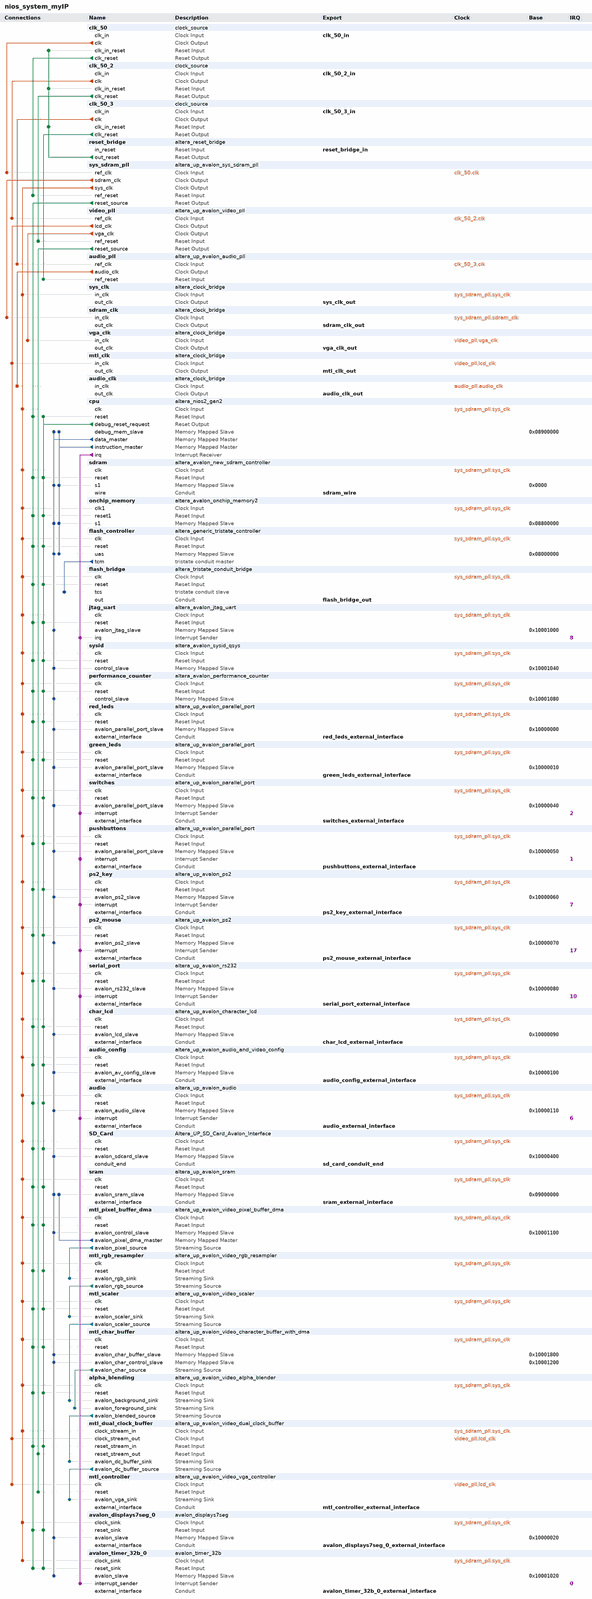
[diagram p0: system contents, whole]
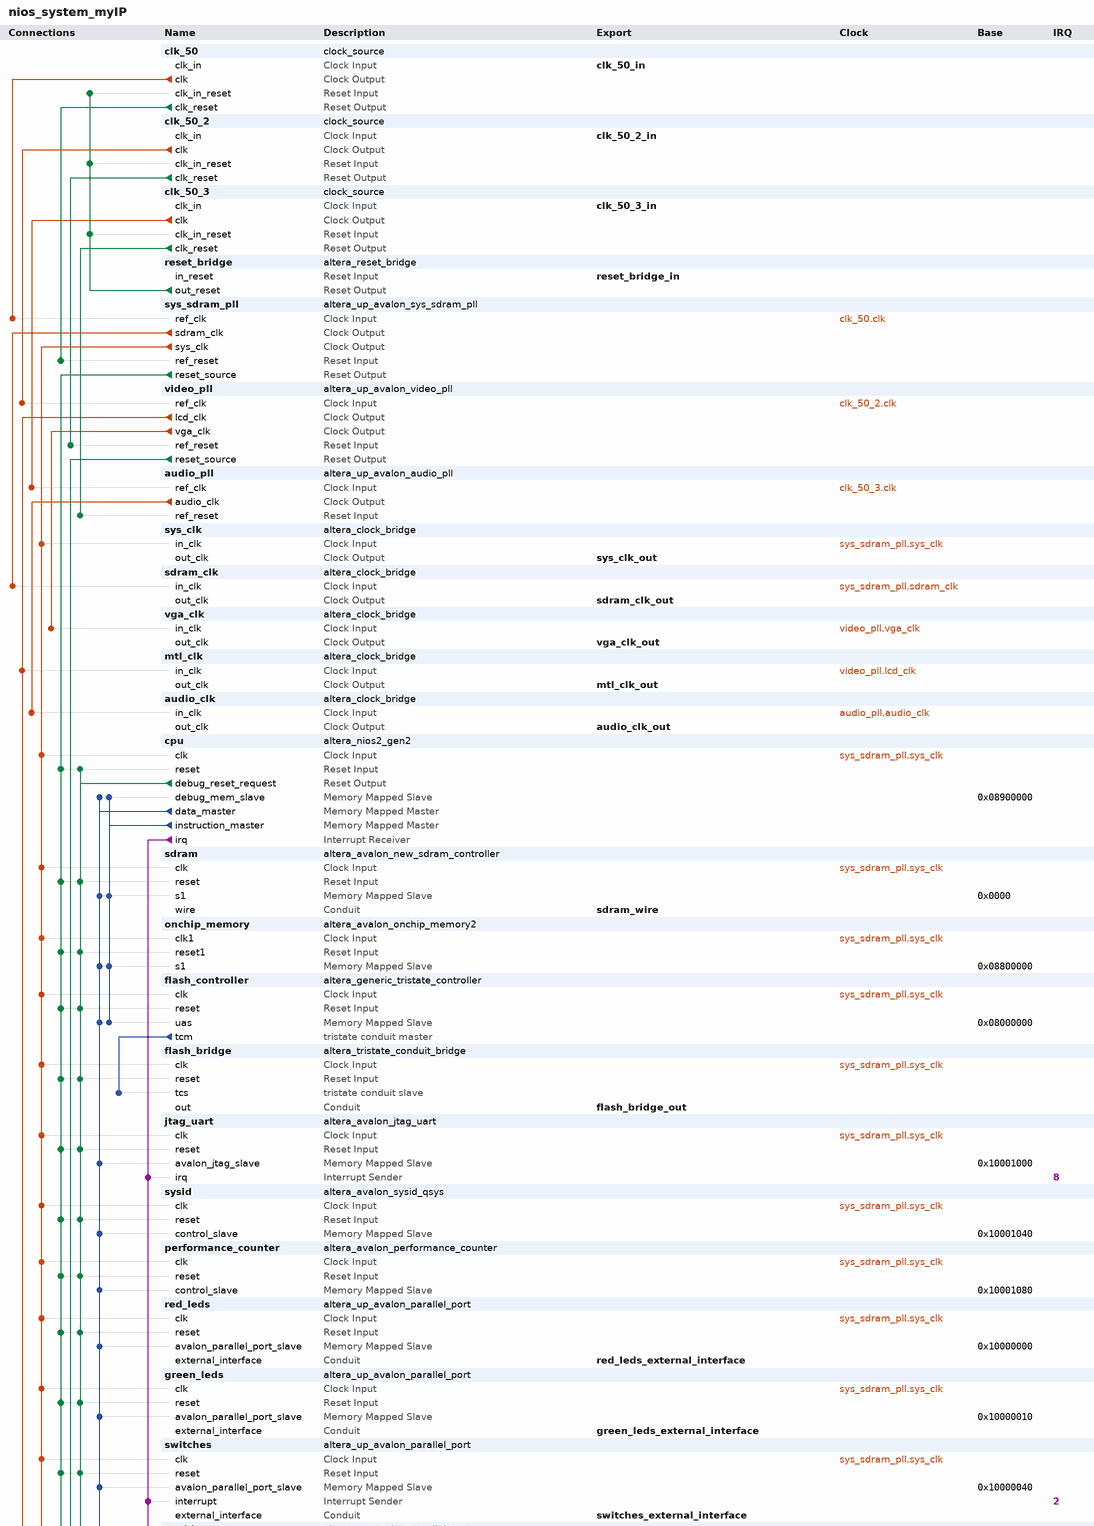
[diagram p1: system contents, upper part]
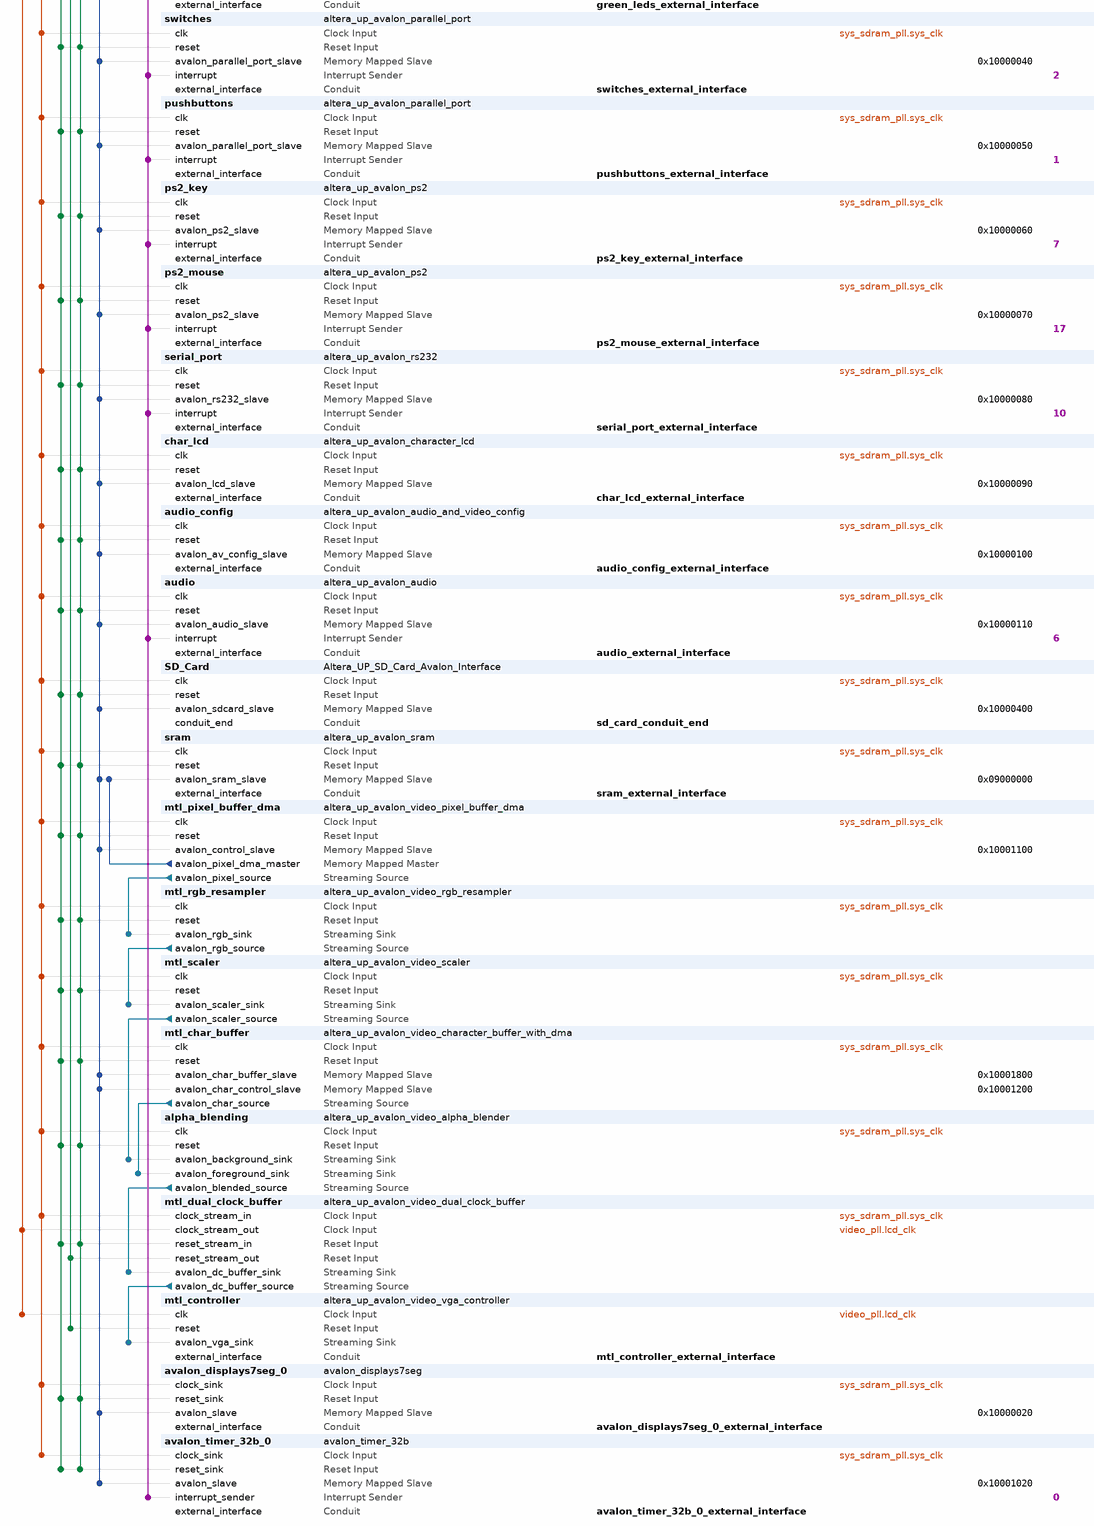
[diagram p2: system contents, lower part]
# Platform Designer (Qsys) system nios_system_myIP, Cyclone IV E EP4CE115F29C7
# Parameters at their usual value, and those the tool derives, are not listed.
package require -exact qsys 17.1
create_system nios_system_myIP
set_project_property DEVICE_FAMILY {Cyclone IV E}
set_project_property DEVICE EP4CE115F29C7

add_instance clk_50 clock_source 17.1
set_instance_parameter_value clk_50 clockFrequency 50000000

add_instance clk_50_2 clock_source 17.1
set_instance_parameter_value clk_50_2 clockFrequency 50000000

add_instance clk_50_3 clock_source 17.1
set_instance_parameter_value clk_50_3 clockFrequency 50000000

add_instance reset_bridge altera_reset_bridge 17.1
set_instance_parameter_value reset_bridge ACTIVE_LOW_RESET 1
set_instance_parameter_value reset_bridge SYNCHRONOUS_EDGES none

add_instance sys_sdram_pll altera_up_avalon_sys_sdram_pll 17.1
set_instance_parameter_value sys_sdram_pll CV_boards DE10-Standard
set_instance_parameter_value sys_sdram_pll gui_outclk 50.0
set_instance_parameter_value sys_sdram_pll gui_refclk 50.0

add_instance video_pll altera_up_avalon_video_pll 17.1
set_instance_parameter_value video_pll camera {5MP Digital Camera (THDB_D5M)}
set_instance_parameter_value video_pll gui_refclk 50.0
set_instance_parameter_value video_pll lcd {7" LCD on VEEK-MT and MTL/MTL2 Modules}
set_instance_parameter_value video_pll lcd_clk_en true

add_instance audio_pll altera_up_avalon_audio_pll 17.1
set_instance_parameter_value audio_pll gui_refclk 50.0

add_instance sys_clk altera_clock_bridge 17.1
set_instance_parameter_value sys_clk DERIVED_CLOCK_RATE 50000000
set_instance_parameter_value sys_clk EXPLICIT_CLOCK_RATE 0

add_instance sdram_clk altera_clock_bridge 17.1
set_instance_parameter_value sdram_clk DERIVED_CLOCK_RATE 50000000
set_instance_parameter_value sdram_clk EXPLICIT_CLOCK_RATE 0

add_instance vga_clk altera_clock_bridge 17.1
set_instance_parameter_value vga_clk DERIVED_CLOCK_RATE 25000000
set_instance_parameter_value vga_clk EXPLICIT_CLOCK_RATE 0

add_instance mtl_clk altera_clock_bridge 17.1
set_instance_parameter_value mtl_clk DERIVED_CLOCK_RATE 33300000
set_instance_parameter_value mtl_clk EXPLICIT_CLOCK_RATE 0

add_instance audio_clk altera_clock_bridge 17.1
set_instance_parameter_value audio_clk DERIVED_CLOCK_RATE 12288000
set_instance_parameter_value audio_clk EXPLICIT_CLOCK_RATE 0

add_instance cpu altera_nios2_gen2 17.1
set_instance_parameter_value cpu dcache_size 2048
set_instance_parameter_value cpu debug_datatrigger 2
set_instance_parameter_value cpu debug_hwbreakpoint 2
set_instance_parameter_value cpu exceptionSlave sdram.s1
set_instance_parameter_value cpu icache_size 4096
set_instance_parameter_value cpu impl Fast
set_instance_parameter_value cpu io_regionbase 268435456
set_instance_parameter_value cpu io_regionsize 16384
set_instance_parameter_value cpu resetSlave sdram.s1

add_instance sdram altera_avalon_new_sdram_controller 17.1
set_instance_parameter_value sdram TAC 5.5
set_instance_parameter_value sdram TRCD 20.0
set_instance_parameter_value sdram TRP 20.0
set_instance_parameter_value sdram casLatency 3
set_instance_parameter_value sdram columnWidth 10
set_instance_parameter_value sdram dataWidth 32
set_instance_parameter_value sdram generateSimulationModel true
set_instance_parameter_value sdram model single_Micron_MT48LC4M32B2_7_chip
set_instance_parameter_value sdram numberOfBanks 4
set_instance_parameter_value sdram numberOfChipSelects 1
set_instance_parameter_value sdram powerUpDelay 200.0
set_instance_parameter_value sdram refreshPeriod 7.8125
set_instance_parameter_value sdram rowWidth 13

add_instance onchip_memory altera_avalon_onchip_memory2 17.1
set_instance_parameter_value onchip_memory dataWidth 32
set_instance_parameter_value onchip_memory dualPort false
set_instance_parameter_value onchip_memory initMemContent true
set_instance_parameter_value onchip_memory initializationFileName onchip_mem.hex
set_instance_parameter_value onchip_memory memorySize 32768

add_instance flash_controller altera_generic_tristate_controller 17.1
set_instance_parameter_value flash_controller ACTIVE_LOW_BEGINTRANSFER 0
set_instance_parameter_value flash_controller ACTIVE_LOW_BYTEENABLE 0
set_instance_parameter_value flash_controller ACTIVE_LOW_OUTPUTENABLE 0
set_instance_parameter_value flash_controller ACTIVE_LOW_READ 1
set_instance_parameter_value flash_controller CHIPSELECT_THROUGH_READLATENCY 0
set_instance_parameter_value flash_controller INTERFACE_ASSIGNMENT_KEYS embeddedsw.configuration.isFlash,embeddedsw.configuration.isMemoryDevice,embeddedsw.configuration.isNonVolatileStorage
set_instance_parameter_value flash_controller INTERFACE_ASSIGNMENT_VALUES 1,1,1
set_instance_parameter_value flash_controller MODULE_ASSIGNMENT_KEYS embeddedsw.configuration.hwClassnameDriverSupportList,embeddedsw.configuration.hwClassnameDriverSupportDefault,embeddedsw.CMacro.SETUP_VALUE,embeddedsw.CMacro.WAIT_VALUE,embeddedsw.CMacro.HOLD_VALUE,embeddedsw.CMacro.TIMING_UNITS,embeddedsw.CMacro.SIZE,embeddedsw.memoryInfo.MEM_INIT_DATA_WIDTH,embeddedsw.memoryInfo.HAS_BYTE_LANE,embeddedsw.memoryInfo.IS_FLASH,embeddedsw.memoryInfo.GENERATE_DAT_SYM,embeddedsw.memoryInfo.GENERATE_FLASH,embeddedsw.memoryInfo.DAT_SYM_INSTALL_DIR,embeddedsw.memoryInfo.FLASH_INSTALL_DIR
set_instance_parameter_value flash_controller MODULE_ASSIGNMENT_VALUES altera_avalon_lan91c111:altera_avalon_cfi_flash,altera_avalon_cfi_flash,0,0,0,ns,8388608u,8,0,1,1,1,SIM_DIR,APP_DIR
set_instance_parameter_value flash_controller TCM_ADDRESS_W 23
set_instance_parameter_value flash_controller TCM_BYTEENABLE_W 1
set_instance_parameter_value flash_controller TCM_DATA_HOLD 60
set_instance_parameter_value flash_controller TCM_DATA_W 8
set_instance_parameter_value flash_controller TCM_MAX_PENDING_READ_TRANSACTIONS 3
set_instance_parameter_value flash_controller TCM_READLATENCY 2
set_instance_parameter_value flash_controller TCM_READ_WAIT 160
set_instance_parameter_value flash_controller TCM_SETUP_WAIT 60
set_instance_parameter_value flash_controller TCM_SYMBOLS_PER_WORD 1
set_instance_parameter_value flash_controller TCM_TIMING_UNITS 0
set_instance_parameter_value flash_controller TCM_TURNAROUND_TIME 2
set_instance_parameter_value flash_controller TCM_WRITE_WAIT 160
set_instance_parameter_value flash_controller USE_BEGINTRANSFER 0
set_instance_parameter_value flash_controller USE_BYTEENABLE 0
set_instance_parameter_value flash_controller USE_OUTPUTENABLE 0
set_instance_parameter_value flash_controller USE_READ 1

add_instance flash_bridge altera_tristate_conduit_bridge 17.1

add_instance jtag_uart altera_avalon_jtag_uart 17.1
set_instance_parameter_value jtag_uart simInteractiveOptions NO_INTERACTIVE_WINDOWS

add_instance sysid altera_avalon_sysid_qsys 17.1
set_instance_parameter_value sysid id 0

add_instance performance_counter altera_avalon_performance_counter 17.1
set_instance_parameter_value performance_counter numberOfSections 3

add_instance red_leds altera_up_avalon_parallel_port 17.1
set_instance_parameter_value red_leds board DE2-115
set_instance_parameter_value red_leds capture false
set_instance_parameter_value red_leds edge Rising
set_instance_parameter_value red_leds irq false
set_instance_parameter_value red_leds leds Red
set_instance_parameter_value red_leds preset LEDs

add_instance green_leds altera_up_avalon_parallel_port 17.1
set_instance_parameter_value green_leds board DE2-115
set_instance_parameter_value green_leds capture false
set_instance_parameter_value green_leds edge Rising
set_instance_parameter_value green_leds irq false
set_instance_parameter_value green_leds preset LEDs

add_instance switches altera_up_avalon_parallel_port 17.1
set_instance_parameter_value switches board DE2-115
set_instance_parameter_value switches capture true
set_instance_parameter_value switches edge Either
set_instance_parameter_value switches irq true
set_instance_parameter_value switches preset {Slider Switches}

add_instance pushbuttons altera_up_avalon_parallel_port 17.1
set_instance_parameter_value pushbuttons board DE2-115
set_instance_parameter_value pushbuttons capture true
set_instance_parameter_value pushbuttons edge Falling
set_instance_parameter_value pushbuttons irq true
set_instance_parameter_value pushbuttons preset Pushbuttons

add_instance ps2_key altera_up_avalon_ps2 17.1

add_instance ps2_mouse altera_up_avalon_ps2 17.1

add_instance serial_port altera_up_avalon_rs232 17.1
set_instance_parameter_value serial_port baud 115200
set_instance_parameter_value serial_port parity None

add_instance char_lcd altera_up_avalon_character_lcd 17.1
set_instance_parameter_value char_lcd cursor Both

add_instance audio_config altera_up_avalon_audio_and_video_config 17.1
set_instance_parameter_value audio_config audio_in {Microphone to ADC}
set_instance_parameter_value audio_config bit_length 32
set_instance_parameter_value audio_config board DE10-Standard
set_instance_parameter_value audio_config line_in_bypass true
set_instance_parameter_value audio_config sampling_rate {48 kHz}
set_instance_parameter_value audio_config video_format PAL

add_instance audio altera_up_avalon_audio 17.1
set_instance_parameter_value audio audio_in true
set_instance_parameter_value audio avalon_bus_type {Memory Mapped}
set_instance_parameter_value audio dw 32

add_instance SD_Card Altera_UP_SD_Card_Avalon_Interface 17.1

add_instance sram altera_up_avalon_sram 17.1
set_instance_parameter_value sram board DE2-115
set_instance_parameter_value sram pixel_buffer true

add_instance mtl_pixel_buffer_dma altera_up_avalon_video_pixel_buffer_dma 17.1
set_instance_parameter_value mtl_pixel_buffer_dma addr_mode X-Y
set_instance_parameter_value mtl_pixel_buffer_dma back_start_address 150994944
set_instance_parameter_value mtl_pixel_buffer_dma color_space {16-bit RGB}
set_instance_parameter_value mtl_pixel_buffer_dma image_height 240
set_instance_parameter_value mtl_pixel_buffer_dma image_width 400
set_instance_parameter_value mtl_pixel_buffer_dma start_address 150994944

add_instance mtl_rgb_resampler altera_up_avalon_video_rgb_resampler 17.1
set_instance_parameter_value mtl_rgb_resampler alpha 1023
set_instance_parameter_value mtl_rgb_resampler input_type {16-bit RGB}
set_instance_parameter_value mtl_rgb_resampler output_type {30-bit RGB}

add_instance mtl_scaler altera_up_avalon_video_scaler 17.1
set_instance_parameter_value mtl_scaler color_bits 10
set_instance_parameter_value mtl_scaler color_planes 3
set_instance_parameter_value mtl_scaler height_scaling 2
set_instance_parameter_value mtl_scaler width_in 400
set_instance_parameter_value mtl_scaler width_scaling 2

add_instance mtl_char_buffer altera_up_avalon_video_character_buffer_with_dma 17.1
set_instance_parameter_value mtl_char_buffer enable_transparency true
set_instance_parameter_value mtl_char_buffer vga_device {LCD with touchscreen (TRDB_LTM)}

add_instance alpha_blending altera_up_avalon_video_alpha_blender 17.1

add_instance mtl_dual_clock_buffer altera_up_avalon_video_dual_clock_buffer 17.1
set_instance_parameter_value mtl_dual_clock_buffer color_bits 10

add_instance mtl_controller altera_up_avalon_video_vga_controller 17.1
set_instance_parameter_value mtl_controller board DE2-115
set_instance_parameter_value mtl_controller resolution {VGA 640x480}

add_instance avalon_displays7seg_0 avalon_displays7seg 1.0
set_instance_parameter_value avalon_displays7seg_0 invert 1

add_instance avalon_timer_32b_0 avalon_timer_32b 1.0

# connections
add_connection audio_pll.audio_clk audio_clk.in_clk clock
add_connection clk_50.clk sys_sdram_pll.ref_clk clock
add_connection clk_50_2.clk video_pll.ref_clk clock
add_connection clk_50_3.clk audio_pll.ref_clk clock
add_connection sys_sdram_pll.sdram_clk sdram_clk.in_clk clock
add_connection sys_sdram_pll.sys_clk alpha_blending.clk clock
add_connection sys_sdram_pll.sys_clk audio.clk clock
add_connection sys_sdram_pll.sys_clk audio_config.clk clock
add_connection sys_sdram_pll.sys_clk avalon_displays7seg_0.clock_sink clock
add_connection sys_sdram_pll.sys_clk avalon_timer_32b_0.clock_sink clock
add_connection sys_sdram_pll.sys_clk char_lcd.clk clock
add_connection sys_sdram_pll.sys_clk cpu.clk clock
add_connection sys_sdram_pll.sys_clk flash_bridge.clk clock
add_connection sys_sdram_pll.sys_clk flash_controller.clk clock
add_connection sys_sdram_pll.sys_clk green_leds.clk clock
add_connection sys_sdram_pll.sys_clk jtag_uart.clk clock
add_connection sys_sdram_pll.sys_clk mtl_char_buffer.clk clock
add_connection sys_sdram_pll.sys_clk mtl_dual_clock_buffer.clock_stream_in clock
add_connection sys_sdram_pll.sys_clk mtl_pixel_buffer_dma.clk clock
add_connection sys_sdram_pll.sys_clk mtl_rgb_resampler.clk clock
add_connection sys_sdram_pll.sys_clk mtl_scaler.clk clock
add_connection sys_sdram_pll.sys_clk onchip_memory.clk1 clock
add_connection sys_sdram_pll.sys_clk performance_counter.clk clock
add_connection sys_sdram_pll.sys_clk ps2_key.clk clock
add_connection sys_sdram_pll.sys_clk ps2_mouse.clk clock
add_connection sys_sdram_pll.sys_clk pushbuttons.clk clock
add_connection sys_sdram_pll.sys_clk red_leds.clk clock
add_connection sys_sdram_pll.sys_clk SD_Card.clk clock
add_connection sys_sdram_pll.sys_clk sdram.clk clock
add_connection sys_sdram_pll.sys_clk serial_port.clk clock
add_connection sys_sdram_pll.sys_clk sram.clk clock
add_connection sys_sdram_pll.sys_clk switches.clk clock
add_connection sys_sdram_pll.sys_clk sys_clk.in_clk clock
add_connection sys_sdram_pll.sys_clk sysid.clk clock
add_connection video_pll.lcd_clk mtl_clk.in_clk clock
add_connection video_pll.lcd_clk mtl_controller.clk clock
add_connection video_pll.lcd_clk mtl_dual_clock_buffer.clock_stream_out clock
add_connection video_pll.vga_clk vga_clk.in_clk clock
add_connection clk_50.clk_reset sys_sdram_pll.ref_reset reset
add_connection clk_50_2.clk_reset video_pll.ref_reset reset
add_connection clk_50_3.clk_reset audio_pll.ref_reset reset
add_connection cpu.debug_reset_request alpha_blending.reset reset
add_connection cpu.debug_reset_request audio.reset reset
add_connection cpu.debug_reset_request audio_config.reset reset
add_connection cpu.debug_reset_request avalon_displays7seg_0.reset_sink reset
add_connection cpu.debug_reset_request avalon_timer_32b_0.reset_sink reset
add_connection cpu.debug_reset_request char_lcd.reset reset
add_connection cpu.debug_reset_request cpu.reset reset
add_connection cpu.debug_reset_request flash_bridge.reset reset
add_connection cpu.debug_reset_request flash_controller.reset reset
add_connection cpu.debug_reset_request green_leds.reset reset
add_connection cpu.debug_reset_request jtag_uart.reset reset
add_connection cpu.debug_reset_request mtl_char_buffer.reset reset
add_connection cpu.debug_reset_request mtl_dual_clock_buffer.reset_stream_in reset
add_connection cpu.debug_reset_request mtl_pixel_buffer_dma.reset reset
add_connection cpu.debug_reset_request mtl_rgb_resampler.reset reset
add_connection cpu.debug_reset_request mtl_scaler.reset reset
add_connection cpu.debug_reset_request onchip_memory.reset1 reset
add_connection cpu.debug_reset_request performance_counter.reset reset
add_connection cpu.debug_reset_request ps2_key.reset reset
add_connection cpu.debug_reset_request ps2_mouse.reset reset
add_connection cpu.debug_reset_request pushbuttons.reset reset
add_connection cpu.debug_reset_request red_leds.reset reset
add_connection cpu.debug_reset_request SD_Card.reset reset
add_connection cpu.debug_reset_request sdram.reset reset
add_connection cpu.debug_reset_request serial_port.reset reset
add_connection cpu.debug_reset_request sram.reset reset
add_connection cpu.debug_reset_request switches.reset reset
add_connection cpu.debug_reset_request sysid.reset reset
add_connection reset_bridge.out_reset clk_50.clk_in_reset reset
add_connection reset_bridge.out_reset clk_50_2.clk_in_reset reset
add_connection reset_bridge.out_reset clk_50_3.clk_in_reset reset
add_connection sys_sdram_pll.reset_source alpha_blending.reset reset
add_connection sys_sdram_pll.reset_source audio.reset reset
add_connection sys_sdram_pll.reset_source audio_config.reset reset
add_connection sys_sdram_pll.reset_source avalon_displays7seg_0.reset_sink reset
add_connection sys_sdram_pll.reset_source avalon_timer_32b_0.reset_sink reset
add_connection sys_sdram_pll.reset_source char_lcd.reset reset
add_connection sys_sdram_pll.reset_source cpu.reset reset
add_connection sys_sdram_pll.reset_source flash_bridge.reset reset
add_connection sys_sdram_pll.reset_source flash_controller.reset reset
add_connection sys_sdram_pll.reset_source green_leds.reset reset
add_connection sys_sdram_pll.reset_source jtag_uart.reset reset
add_connection sys_sdram_pll.reset_source mtl_char_buffer.reset reset
add_connection sys_sdram_pll.reset_source mtl_dual_clock_buffer.reset_stream_in reset
add_connection sys_sdram_pll.reset_source mtl_pixel_buffer_dma.reset reset
add_connection sys_sdram_pll.reset_source mtl_rgb_resampler.reset reset
add_connection sys_sdram_pll.reset_source mtl_scaler.reset reset
add_connection sys_sdram_pll.reset_source onchip_memory.reset1 reset
add_connection sys_sdram_pll.reset_source performance_counter.reset reset
add_connection sys_sdram_pll.reset_source ps2_key.reset reset
add_connection sys_sdram_pll.reset_source ps2_mouse.reset reset
add_connection sys_sdram_pll.reset_source pushbuttons.reset reset
add_connection sys_sdram_pll.reset_source red_leds.reset reset
add_connection sys_sdram_pll.reset_source SD_Card.reset reset
add_connection sys_sdram_pll.reset_source sdram.reset reset
add_connection sys_sdram_pll.reset_source serial_port.reset reset
add_connection sys_sdram_pll.reset_source sram.reset reset
add_connection sys_sdram_pll.reset_source switches.reset reset
add_connection sys_sdram_pll.reset_source sysid.reset reset
add_connection video_pll.reset_source mtl_controller.reset reset
add_connection video_pll.reset_source mtl_dual_clock_buffer.reset_stream_out reset
add_connection cpu.data_master audio.avalon_audio_slave avalon
set_connection_parameter_value cpu.data_master/audio.avalon_audio_slave baseAddress 0x10000110
add_connection cpu.data_master audio_config.avalon_av_config_slave avalon
set_connection_parameter_value cpu.data_master/audio_config.avalon_av_config_slave baseAddress 0x10000100
add_connection cpu.data_master avalon_displays7seg_0.avalon_slave avalon
set_connection_parameter_value cpu.data_master/avalon_displays7seg_0.avalon_slave baseAddress 0x10000020
add_connection cpu.data_master avalon_timer_32b_0.avalon_slave avalon
set_connection_parameter_value cpu.data_master/avalon_timer_32b_0.avalon_slave baseAddress 0x10001020
add_connection cpu.data_master char_lcd.avalon_lcd_slave avalon
set_connection_parameter_value cpu.data_master/char_lcd.avalon_lcd_slave baseAddress 0x10000090
add_connection cpu.data_master cpu.debug_mem_slave avalon
set_connection_parameter_value cpu.data_master/cpu.debug_mem_slave baseAddress 0x08900000
add_connection cpu.data_master flash_controller.uas avalon
set_connection_parameter_value cpu.data_master/flash_controller.uas baseAddress 0x08000000
add_connection cpu.data_master green_leds.avalon_parallel_port_slave avalon
set_connection_parameter_value cpu.data_master/green_leds.avalon_parallel_port_slave baseAddress 0x10000010
add_connection cpu.data_master jtag_uart.avalon_jtag_slave avalon
set_connection_parameter_value cpu.data_master/jtag_uart.avalon_jtag_slave baseAddress 0x10001000
add_connection cpu.data_master mtl_char_buffer.avalon_char_buffer_slave avalon
set_connection_parameter_value cpu.data_master/mtl_char_buffer.avalon_char_buffer_slave baseAddress 0x10001800
add_connection cpu.data_master mtl_char_buffer.avalon_char_control_slave avalon
set_connection_parameter_value cpu.data_master/mtl_char_buffer.avalon_char_control_slave baseAddress 0x10001200
add_connection cpu.data_master mtl_pixel_buffer_dma.avalon_control_slave avalon
set_connection_parameter_value cpu.data_master/mtl_pixel_buffer_dma.avalon_control_slave baseAddress 0x10001100
add_connection cpu.data_master onchip_memory.s1 avalon
set_connection_parameter_value cpu.data_master/onchip_memory.s1 baseAddress 0x08800000
add_connection cpu.data_master performance_counter.control_slave avalon
set_connection_parameter_value cpu.data_master/performance_counter.control_slave baseAddress 0x10001080
add_connection cpu.data_master ps2_key.avalon_ps2_slave avalon
set_connection_parameter_value cpu.data_master/ps2_key.avalon_ps2_slave baseAddress 0x10000060
add_connection cpu.data_master ps2_mouse.avalon_ps2_slave avalon
set_connection_parameter_value cpu.data_master/ps2_mouse.avalon_ps2_slave baseAddress 0x10000070
add_connection cpu.data_master pushbuttons.avalon_parallel_port_slave avalon
set_connection_parameter_value cpu.data_master/pushbuttons.avalon_parallel_port_slave baseAddress 0x10000050
add_connection cpu.data_master red_leds.avalon_parallel_port_slave avalon
set_connection_parameter_value cpu.data_master/red_leds.avalon_parallel_port_slave baseAddress 0x10000000
add_connection cpu.data_master SD_Card.avalon_sdcard_slave avalon
set_connection_parameter_value cpu.data_master/SD_Card.avalon_sdcard_slave baseAddress 0x10000400
add_connection cpu.data_master sdram.s1 avalon
set_connection_parameter_value cpu.data_master/sdram.s1 baseAddress 0x0000
add_connection cpu.data_master serial_port.avalon_rs232_slave avalon
set_connection_parameter_value cpu.data_master/serial_port.avalon_rs232_slave baseAddress 0x10000080
add_connection cpu.data_master sram.avalon_sram_slave avalon
set_connection_parameter_value cpu.data_master/sram.avalon_sram_slave baseAddress 0x09000000
add_connection cpu.data_master switches.avalon_parallel_port_slave avalon
set_connection_parameter_value cpu.data_master/switches.avalon_parallel_port_slave baseAddress 0x10000040
add_connection cpu.data_master sysid.control_slave avalon
set_connection_parameter_value cpu.data_master/sysid.control_slave baseAddress 0x10001040
add_connection cpu.instruction_master cpu.debug_mem_slave avalon
set_connection_parameter_value cpu.instruction_master/cpu.debug_mem_slave baseAddress 0x08900000
add_connection cpu.instruction_master flash_controller.uas avalon
set_connection_parameter_value cpu.instruction_master/flash_controller.uas baseAddress 0x08000000
add_connection cpu.instruction_master onchip_memory.s1 avalon
set_connection_parameter_value cpu.instruction_master/onchip_memory.s1 baseAddress 0x08800000
add_connection cpu.instruction_master sdram.s1 avalon
set_connection_parameter_value cpu.instruction_master/sdram.s1 baseAddress 0x0000
add_connection mtl_pixel_buffer_dma.avalon_pixel_dma_master sram.avalon_sram_slave avalon
set_connection_parameter_value mtl_pixel_buffer_dma.avalon_pixel_dma_master/sram.avalon_sram_slave baseAddress 0x09000000
add_connection alpha_blending.avalon_blended_source mtl_dual_clock_buffer.avalon_dc_buffer_sink avalon_streaming
add_connection mtl_char_buffer.avalon_char_source alpha_blending.avalon_foreground_sink avalon_streaming
add_connection mtl_dual_clock_buffer.avalon_dc_buffer_source mtl_controller.avalon_vga_sink avalon_streaming
add_connection mtl_pixel_buffer_dma.avalon_pixel_source mtl_rgb_resampler.avalon_rgb_sink avalon_streaming
add_connection mtl_rgb_resampler.avalon_rgb_source mtl_scaler.avalon_scaler_sink avalon_streaming
add_connection mtl_scaler.avalon_scaler_source alpha_blending.avalon_background_sink avalon_streaming
add_connection cpu.irq audio.interrupt interrupt
set_connection_parameter_value cpu.irq/audio.interrupt irqNumber 6
add_connection cpu.irq avalon_timer_32b_0.interrupt_sender interrupt
set_connection_parameter_value cpu.irq/avalon_timer_32b_0.interrupt_sender irqNumber 0
add_connection cpu.irq jtag_uart.irq interrupt
set_connection_parameter_value cpu.irq/jtag_uart.irq irqNumber 8
add_connection cpu.irq ps2_key.interrupt interrupt
set_connection_parameter_value cpu.irq/ps2_key.interrupt irqNumber 7
add_connection cpu.irq ps2_mouse.interrupt interrupt
set_connection_parameter_value cpu.irq/ps2_mouse.interrupt irqNumber 17
add_connection cpu.irq pushbuttons.interrupt interrupt
set_connection_parameter_value cpu.irq/pushbuttons.interrupt irqNumber 1
add_connection cpu.irq serial_port.interrupt interrupt
set_connection_parameter_value cpu.irq/serial_port.interrupt irqNumber 10
add_connection cpu.irq switches.interrupt interrupt
set_connection_parameter_value cpu.irq/switches.interrupt irqNumber 2
add_connection flash_controller.tcm flash_bridge.tcs tristate_conduit

# exported interfaces
add_interface audio_clk_out clock source
set_interface_property audio_clk_out EXPORT_OF audio_clk.out_clk
add_interface audio_config_external_interface conduit end
set_interface_property audio_config_external_interface EXPORT_OF audio_config.external_interface
add_interface audio_external_interface conduit end
set_interface_property audio_external_interface EXPORT_OF audio.external_interface
add_interface avalon_displays7seg_0_external_interface conduit end
set_interface_property avalon_displays7seg_0_external_interface EXPORT_OF avalon_displays7seg_0.external_interface
add_interface avalon_timer_32b_0_external_interface conduit end
set_interface_property avalon_timer_32b_0_external_interface EXPORT_OF avalon_timer_32b_0.external_interface
add_interface char_lcd_external_interface conduit end
set_interface_property char_lcd_external_interface EXPORT_OF char_lcd.external_interface
add_interface clk_50_2_in clock sink
set_interface_property clk_50_2_in EXPORT_OF clk_50_2.clk_in
add_interface clk_50_3_in clock sink
set_interface_property clk_50_3_in EXPORT_OF clk_50_3.clk_in
add_interface clk_50_in clock sink
set_interface_property clk_50_in EXPORT_OF clk_50.clk_in
add_interface flash_bridge_out conduit end
set_interface_property flash_bridge_out EXPORT_OF flash_bridge.out
add_interface green_leds_external_interface conduit end
set_interface_property green_leds_external_interface EXPORT_OF green_leds.external_interface
add_interface mtl_clk_out clock source
set_interface_property mtl_clk_out EXPORT_OF mtl_clk.out_clk
add_interface mtl_controller_external_interface conduit end
set_interface_property mtl_controller_external_interface EXPORT_OF mtl_controller.external_interface
add_interface ps2_key_external_interface conduit end
set_interface_property ps2_key_external_interface EXPORT_OF ps2_key.external_interface
add_interface ps2_mouse_external_interface conduit end
set_interface_property ps2_mouse_external_interface EXPORT_OF ps2_mouse.external_interface
add_interface pushbuttons_external_interface conduit end
set_interface_property pushbuttons_external_interface EXPORT_OF pushbuttons.external_interface
add_interface red_leds_external_interface conduit end
set_interface_property red_leds_external_interface EXPORT_OF red_leds.external_interface
add_interface reset_bridge_in reset sink
set_interface_property reset_bridge_in EXPORT_OF reset_bridge.in_reset
add_interface sd_card_conduit_end conduit end
set_interface_property sd_card_conduit_end EXPORT_OF SD_Card.conduit_end
add_interface sdram_clk_out clock source
set_interface_property sdram_clk_out EXPORT_OF sdram_clk.out_clk
add_interface sdram_wire conduit end
set_interface_property sdram_wire EXPORT_OF sdram.wire
add_interface serial_port_external_interface conduit end
set_interface_property serial_port_external_interface EXPORT_OF serial_port.external_interface
add_interface sram_external_interface conduit end
set_interface_property sram_external_interface EXPORT_OF sram.external_interface
add_interface switches_external_interface conduit end
set_interface_property switches_external_interface EXPORT_OF switches.external_interface
add_interface sys_clk_out clock source
set_interface_property sys_clk_out EXPORT_OF sys_clk.out_clk
add_interface vga_clk_out clock source
set_interface_property vga_clk_out EXPORT_OF vga_clk.out_clk

set_interconnect_requirement {$system} qsys_mm.clockCrossingAdapter HANDSHAKE
set_interconnect_requirement {$system} qsys_mm.enableEccProtection FALSE
set_interconnect_requirement {$system} qsys_mm.insertDefaultSlave FALSE
set_interconnect_requirement {$system} qsys_mm.maxAdditionalLatency 1

save_system nios_system_myIP.qsys
